# Altium schematic sheet SIWA1-0.SchDoc
size 431 x 279 mm; SheetNumber: 1; SheetTotal: 1
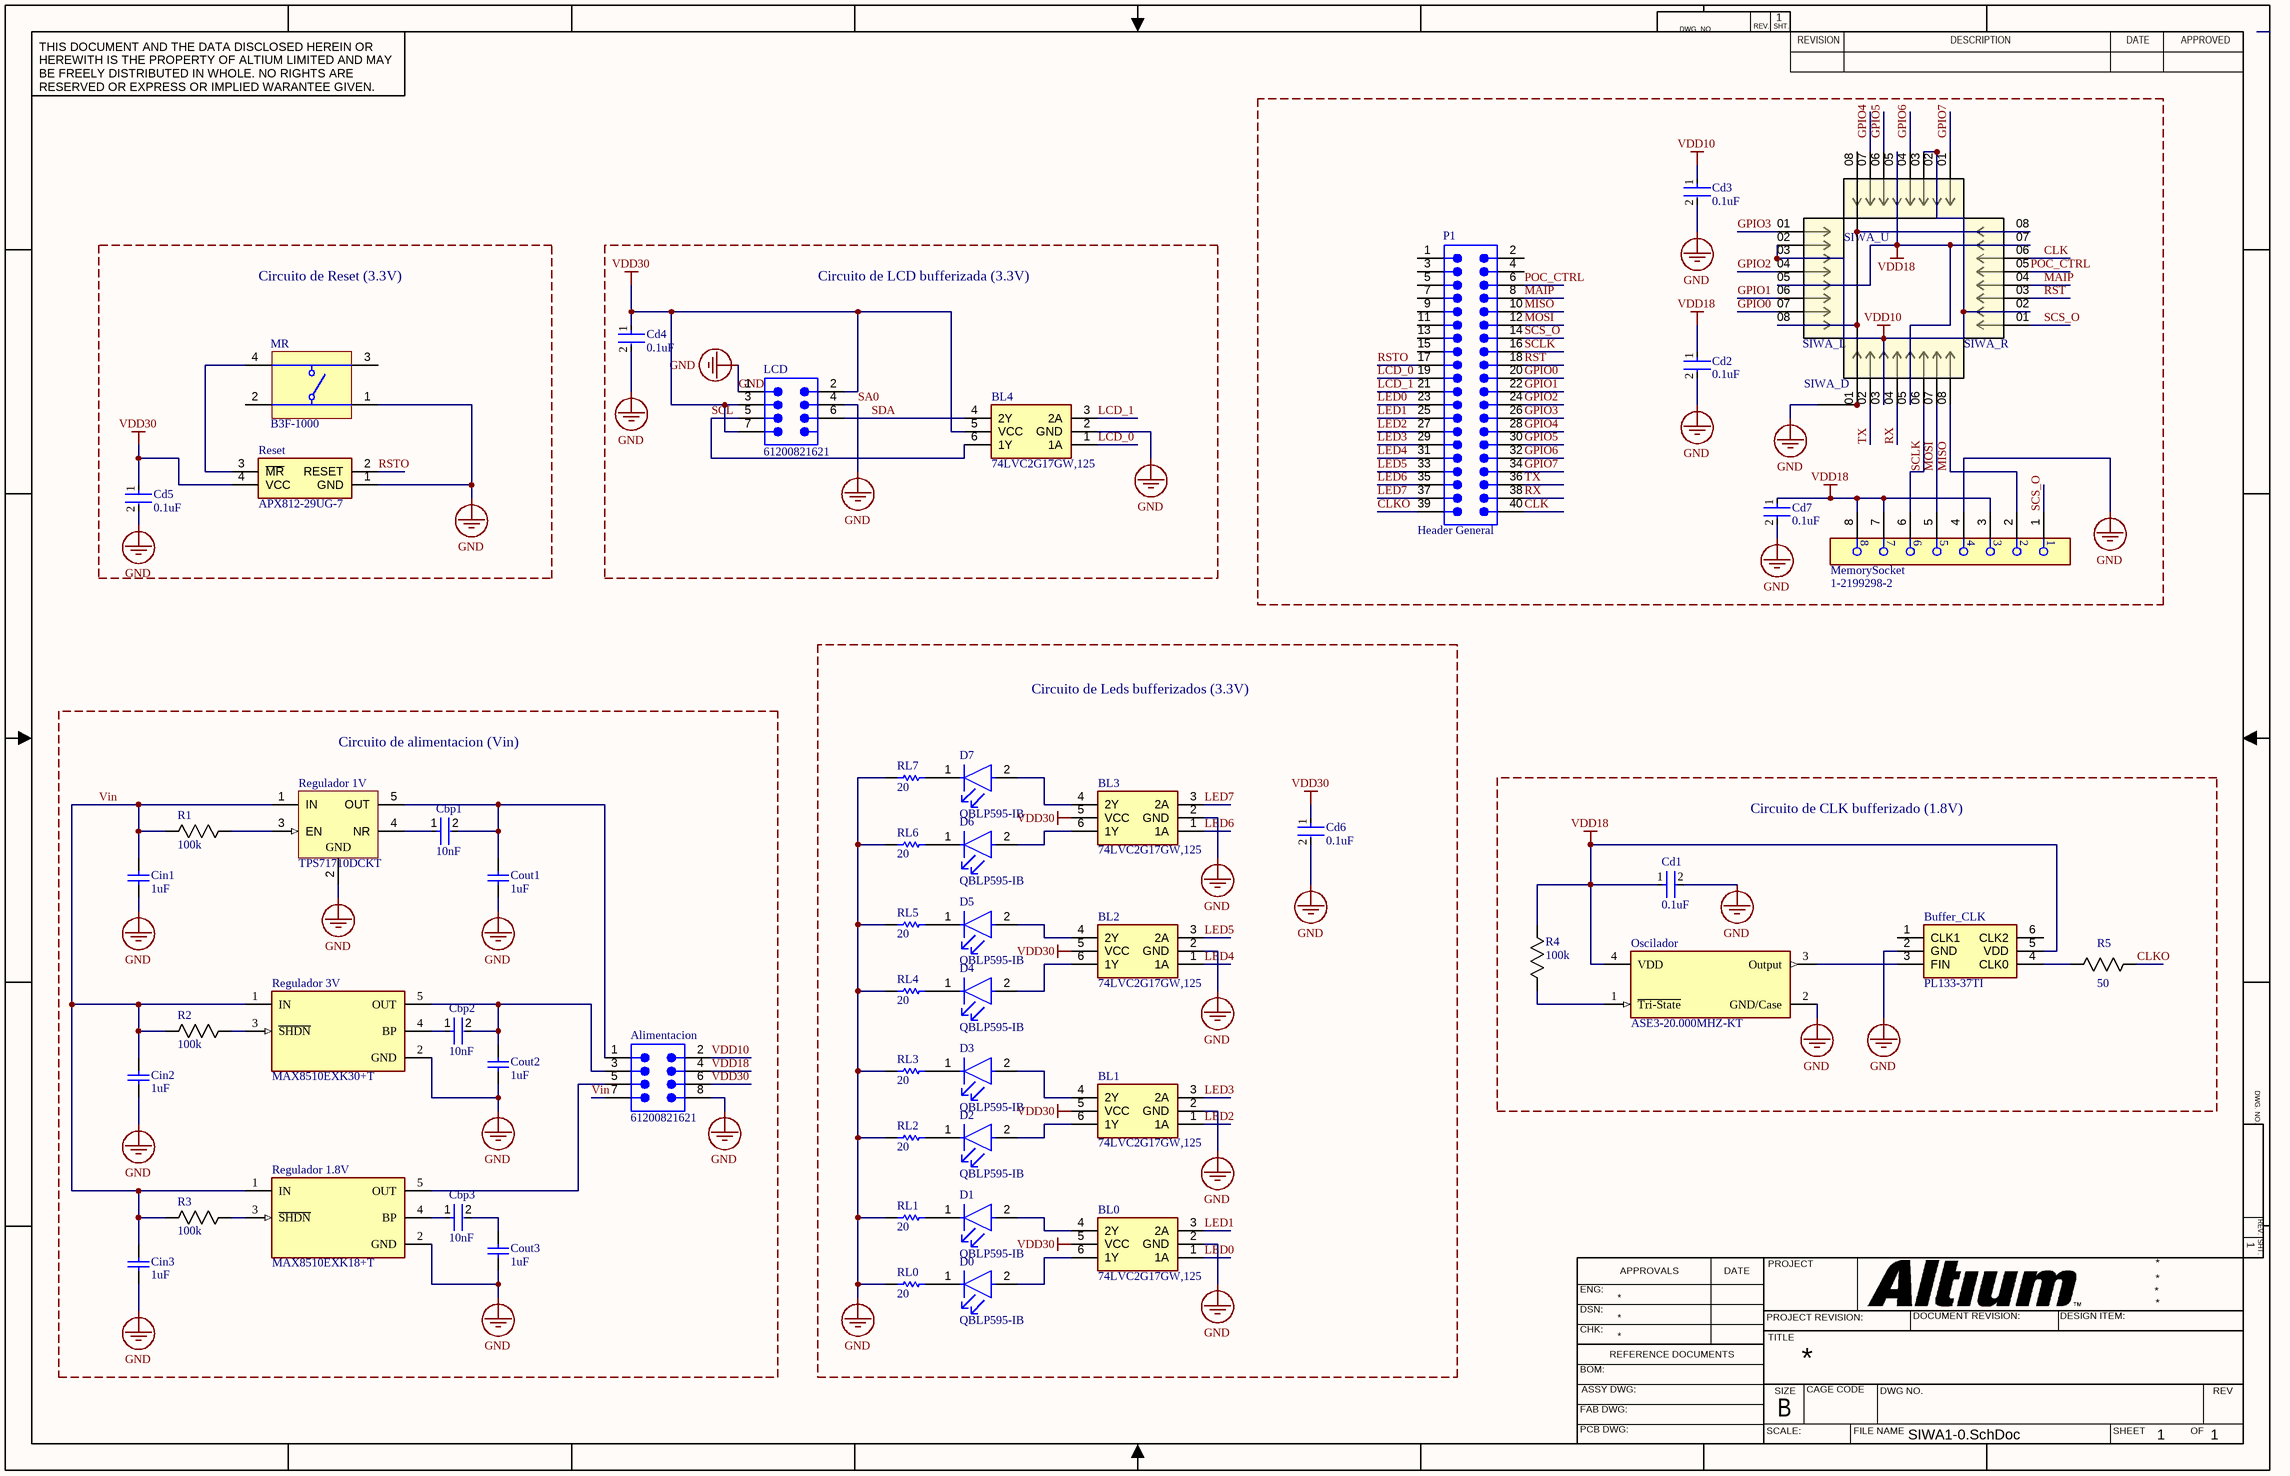
[diagram p0: SIWA1-0.SchDoc]

## Parts
Alimentacion  61200821621  [61200821621]
BL0  74LVC2G17GW,125  [SOT65P210X110-6N]
BL1  74LVC2G17GW,125  [SOT65P210X110-6N]
BL2  74LVC2G17GW,125  [SOT65P210X110-6N]
BL3  74LVC2G17GW,125  [SOT65P210X110-6N]
BL4  74LVC2G17GW,125  [SOT65P210X110-6N]
Buffer_CLK  PL133-37TI  [SOT95P280X145-6N]
Cbp1  10nF  [FP-CGA3E-0_3-0_1-IPC_B]
Cbp2  10nF  [FP-CGA3E-0_3-0_1-IPC_B]
Cbp3  10nF  [FP-CGA3E-0_3-0_1-IPC_B]
Cd1  0.1uF  [FP-0603-L_1_6_0_15-W_0_81-MFG]
Cd2  0.1uF  [FP-0603-L_1_6_0_15-W_0_81-MFG]
Cd3  0.1uF  [FP-0603-L_1_6_0_15-W_0_81-MFG]
Cd4  0.1uF  [FP-0603-L_1_6_0_15-W_0_81-MFG]
Cd5  0.1uF  [FP-0603-L_1_6_0_15-W_0_81-MFG]
Cd6  0.1uF  [FP-0603-L_1_6_0_15-W_0_81-MFG]
Cd7  0.1uF  [FP-0603-L_1_6_0_15-W_0_81-MFG]
Cin1  1uF  [CAPC1609X100X15LL20]
Cin2  1uF  [CAPC1609X100X15LL20]
Cin3  1uF  [CAPC1609X100X15LL20]
Cout1  1uF  [CAPC1609X100X15LL20]
Cout2  1uF  [CAPC1609X100X15LL20]
Cout3  1uF  [CAPC1609X100X15LL20]
D0  QBLP595-IB  [FP-QBLP595-IB-MFG]
D1  QBLP595-IB  [FP-QBLP595-IB-MFG]
D2  QBLP595-IB  [FP-QBLP595-IB-MFG]
D3  QBLP595-IB  [FP-QBLP595-IB-MFG]
D4  QBLP595-IB  [FP-QBLP595-IB-MFG]
D5  QBLP595-IB  [FP-QBLP595-IB-MFG]
D6  QBLP595-IB  [FP-QBLP595-IB-MFG]
D7  QBLP595-IB  [FP-QBLP595-IB-MFG]
LCD  61200821621  [61200821621]
MemorySocket  1-2199298-2  [FP-1-2199298-2-MFG]
MR  B3F-1000  [OMRON-B3F-1000-4_V]
Oscilador  ASE3-20.000MHZ-KT  [FP-ASE3-MFG]
P1  Header General  [61204021621]
R1  100k  [RES_PEP0805-N_VIS]
R2  100k  [RES_PEP0805-N_VIS]
R3  100k  [RES_PEP0805-N_VIS]
R4  100k  [RES_PEP0805-N_VIS]
R5  50  [RES_PEP0805-N_VIS]
Regulador_1.8V  MAX8510EXK18+T  [FP-X5-1-MFG]
Regulador_1V  TPS71710DCKT  [DCK0005A_M]
Regulador_3V  MAX8510EXK30+T  [FP-X5-1-MFG]
Reset  APX812-29UG-7  [APX81229UG7]
RL0  20  [RESC1608X55X30LL15T15]
RL1  20  [RESC1608X55X30LL15T15]
RL2  20  [RESC1608X55X30LL15T15]
RL3  20  [RESC1608X55X30LL15T15]
RL4  20  [RESC1608X55X30LL15T15]
RL5  20  [RESC1608X55X30LL15T15]
RL6  20  [RESC1608X55X30LL15T15]
RL7  20  [RESC1608X55X30LL15T15]
SIWA_D  PPTC081LFBN-RC  [SAMTEC_TS-108-X-A-1]  (value not drawn)
SIWA_L  PPTC081LFBN-RC  [SAMTEC_TS-108-X-A-1]  (value not drawn)
SIWA_R  PPTC081LFBN-RC  [SAMTEC_TS-108-X-A-1]  (value not drawn)
SIWA_U  PPTC081LFBN-RC  [SAMTEC_TS-108-X-A-1]  (value not drawn)

## Blocks framed on the sheet
Circuito de Reset (3.3V): Cd5 MR Reset
Circuito de LCD bufferizada (3.3V): BL4 Cd4 LCD
Circuito de Leds bufferizados (3.3V): BL0-BL3 Cd6 D0-D7 RL0-RL7
Circuito de alimentacion (Vin): Alimentacion Cbp1-Cbp3 Cin1-Cin3 Cout1-Cout3 R1-R3 Regulador_1.8V Regulador_1V Regulador_3V
Circuito de CLK bufferizado (1.8V): Buffer_CLK Cd1 Oscilador R4 R5

## Nets
GND: Alimentacion.8 BL0.2(GND) BL1.2(GND) BL2.2(GND) BL3.2(GND) BL4.2(GND) Buffer_CLK.2(GND) Cd1.2 Cd2.2 Cd3.2 Cd4.2 Cd5.2 Cd6.2 Cd7.2 Cin1.1 Cin2.1 Cin3.1 Cout1.1 Cout2.1 Cout3.1 LCD.1 LCD.4 MemorySocket.4 MR.1 Oscilador.2(GND/Case) Regulador_1.8V.2(GND) Regulador_1V.2(GND) Regulador_3V.2(GND) Reset.1(GND) RL0.1 RL1.1 RL2.1 RL3.1 RL4.1 RL5.1 RL6.1 RL7.1 SIWA_D.01 SIWA_L.08 SIWA_R.08 SIWA_U.08  [also labelled SA0]
VDD10: Alimentacion.2 Cd3.1 SIWA_D.03 SIWA_L.02 SIWA_L.03 SIWA_R.02 SIWA_U.02 SIWA_U.03
VDD18: Alimentacion.4 Buffer_CLK.5(VDD) Cd1.1 Cd2.1 Cd7.1 MemorySocket.3 MemorySocket.7 MemorySocket.8 Oscilador.4(VDD) R4.2 SIWA_D.05 SIWA_L.05 SIWA_R.07 SIWA_U.05
VDD30: Alimentacion.6 BL0.5(VCC) BL1.5(VCC) BL2.5(VCC) BL3.5(VCC) BL4.5(VCC) Cd4.1 Cd5.1 Cd6.1 LCD.2 LCD.3 LCD.7 Reset.4(VCC)
CLK: P1.40 SIWA_R.06
CLKO: P1.39 R5.1
GPIO0: P1.20 SIWA_L.07
GPIO1: P1.22 SIWA_L.06
GPIO2: P1.24 SIWA_L.04
GPIO3: P1.26 SIWA_L.01
GPIO4: P1.28 SIWA_U.07
GPIO5: P1.30 SIWA_U.06
GPIO6: P1.32 SIWA_U.04
GPIO7: P1.34 SIWA_U.01
LCD_0: BL4.1(1A) P1.19
LCD_1: BL4.3(2A) P1.21
LED0: BL0.1(1A) P1.23
LED1: BL0.3(2A) P1.25
LED2: BL1.1(1A) P1.27
LED3: BL1.3(2A) P1.29
LED4: BL2.1(1A) P1.31
LED5: BL2.3(2A) P1.33
LED6: BL3.1(1A) P1.35
LED7: BL3.3(2A) P1.37
MAIP: P1.8 SIWA_R.04
MISO: MemorySocket.2 P1.10 SIWA_D.08
MOSI: MemorySocket.5 P1.12 SIWA_D.07
POC_CTRL: P1.6 SIWA_R.05
RST: P1.18 SIWA_R.03
RSTO: P1.17 Reset.2(RESET)
RX: P1.38 SIWA_D.04
SCL: BL4.6(1Y) LCD.5
SCLK: MemorySocket.6 P1.16 SIWA_D.06
SCS_O: MemorySocket.1 P1.14 SIWA_R.01
SDA: BL4.4(2Y) LCD.6
TX: P1.36 SIWA_D.02
Vin: Alimentacion.7 Cin1.2 Cin2.2 Cin3.2 R1.1 R2.1 R3.1 Regulador_1.8V.1(IN) Regulador_1V.1(IN) Regulador_3V.1(IN)
NetAlimentacion_1: Alimentacion.1 Cbp1.2 Cout1.2 Regulador_1V.5(OUT)
NetAlimentacion_3: Alimentacion.3 Cbp2.2 Cout2.2 Regulador_3V.5(OUT)
NetAlimentacion_5: Alimentacion.5 Regulador_1.8V.5(OUT)
NetBL0_4: BL0.4(2Y) D1.2(A)
NetBL0_6: BL0.6(1Y) D0.2(A)
NetBL1_4: BL1.4(2Y) D3.2(A)
NetBL1_6: BL1.6(1Y) D2.2(A)
NetBL2_4: BL2.4(2Y) D5.2(A)
NetBL2_6: BL2.6(1Y) D4.2(A)
NetBL3_4: BL3.4(2Y) D7.2(A)
NetBL3_6: BL3.6(1Y) D6.2(A)
NetBuffer_CLK_3: Buffer_CLK.3(FIN) Oscilador.3(Output)
NetBuffer_CLK_4: Buffer_CLK.4(CLK0) R5.2
NetCbp1_1: Cbp1.1 Regulador_1V.4(NR)
NetCbp2_1: Cbp2.1 Regulador_3V.4(BP)
NetCbp3_1: Cbp3.1 Regulador_1.8V.4(BP)
NetCbp3_2: Cbp3.2 Cout3.2
NetD0_1: D0.1(C) RL0.2
NetD1_1: D1.1(C) RL1.2
NetD2_1: D2.1(C) RL2.2
NetD3_1: D3.1(C) RL3.2
NetD4_1: D4.1(C) RL4.2
NetD5_1: D5.1(C) RL5.2
NetD6_1: D6.1(C) RL6.2
NetD7_1: D7.1(C) RL7.2
NetMR_4: MR.4 Reset.3(~{MR})
NetOscilador_1: Oscilador.1(~{Tri-State}) R4.1
NetR1_2: R1.2 Regulador_1V.3(EN)
NetR2_2: R2.2 Regulador_3V.3(~{SHDN})
NetR3_2: R3.2 Regulador_1.8V.3(~{SHDN})

Not connected (* = marked no-connect by the designer): Buffer_CLK 1(CLK1) 6(CLK2); LCD 8; MR 2 3; P1 1 2 3 4 5 7 9 11 13 15

## Notes on the sheet
- DWG. NO.
- REV.
- SHT.
- THIS DOCUMENT AND THE DATA DISCLOSED HEREIN OR HEREWITH IS THE PROPERTY OF ALTIUM LIMITED AND MAY BE FREELY DISTRIBUTED IN WHOLE. NO RIGHTS ARE RESERVED OR EXPRESS OR IMPLIED WARANTEE GIVEN.
- REVISION
- DESCRIPTION
- DATE
- APPROVED
- ENG:
- APPROVALS
- PROJECT
- DSN:
- CHK:
- REFERENCE DOCUMENTS
- PROJECT REVISION:
- TITLE
- DOCUMENT REVISION:
- DESIGN ITEM:
- BOM:
- FAB DWG:
- PCB DWG:
- ASSY DWG:
- SCALE:
- SIZE
- B
- CAGE CODE
- FILE NAME
- DWG NO.
- SHEET
- OF
- REV

## Library data of the parts
Alimentacion LCD = CMP-1502-00006-2: NexarPartId: 32855460; Gender: Male; Row Spacing: 2.54mm; Connector Type: Male Pin; Insulation Resistance: 1GΩ; Contact Resistance: 20mΩ; Number of Positions: 8; Current Rating: 3A; Operating Supply Voltage: 250V; Orientation: Vertical; Lead Pitch: 2.54mm; Length: 17.82mm; Max Operating Temperature: 105°C; Mount: Through Hole; Color: Black; Insulation Material: PBT; RoHS: Compliant; Contact Material: Copper; Number of Contacts: 8; Pitch: 2.54mm; Contact Plating: Gold; Min Operating Temperature: -40°C; Number of Pins: 8; Termination: Solder; REACH SVHC: Unknown; Number of Rows: 2
BL0-BL4 = 74LVC2G17GW,125: Integrated Circuit; Manufacturer_Name: Nexperia; Datasheet Link: https://assets.nexperia.com/documents/data-sheet/74LVC2G17.pdf; Height: 1.1mm; Manufacturer_Part_Number: 74LVC2G17GW,125; Mouser Part Number: 771-LVC2G17GW125; Mouser Price/Stock: https://www.mouser.co.uk/ProductDetail/Nexperia/74LVC2G17GW125?qs=me8TqzrmIYUC6E0%2FnH98oA%3D%3D; Arrow Part Number: 74LVC2G17GW,125; Arrow Price/Stock: https://www.arrow.com/en/products/74lvc2g17gw125/nexperia?utm_currency=USD&region=nac
Buffer_CLK = PL133-37TI: Integrated Circuit; Manufacturer_Name: Microchip; Datasheet Link: http://www.microchip.com/mymicrochip/filehandler.aspx?ddocname=en580976; Height: 1.45mm; Manufacturer_Part_Number: PL133-37TI; Mouser Part Number: 998-PL133-37TI; Mouser Price/Stock: https://www.mouser.co.uk/ProductDetail/Microchip-Technology/PL133-37TI?qs=kh6iOki%2FeLE%2FQlQVb6vWpw%3D%3D; Arrow Part Number: PL133-37TI; Arrow Price/Stock: https://www.arrow.com/en/products/pl133-37ti/microchip-technology?utm_currency=USD&region=nac
Cbp1-Cbp3 = CMP-08246-000560-1: Cap Ceramic 10nF 100V C0G 5% Pad SMD 0603 +125°C Automotive T/R; Mount: Surface Mount; Packaging: Tape and Reel; Min Operating Temperature: -55°C; Termination: SMD/SMT; Case Code (Metric): 1608; Voltage Rating (DC): 100V; Package Quantity: 4000; Max Operating Temperature: 125°C; Composition: Ceramic; Dielectric: C0G; Tolerance: 5%; Length: 0.063inch; Height: 0.8mm; Lead Free: Lead Free; Voltage Rating: 100V; Width: 0.031inch; Capacitance: 10nF; Case/Package: 0603; Thickness: 0.035inch; Case Code (Imperial): 0603; Ratings: AEC-Q200; Weight: 7.1E-05oz
Cd1-Cd7 = CMP-07738-136560482-1: KGM15BR71H104JT Cap Cer 0.1UF 50V X7R 0603; Capacitance: 100nF; Tolerance: 5%; Material: Ceramic; NexarPartId: 136560482; Height: 940µm; Voltage Rating: 50V; Case/Package: 0603; Max Operating Temperature: 125°C; Min Operating Temperature: -55°C
Cin1-Cin3 Cout1-Cout3 = CMP-2006-00183-1: Manufacturer: AVX Interconnect / Elco; Part Number: TACL105K006XTA
D0-D7 = CMP-113271-000002-1: LED BLUE CLEAR 0402 SMD; Lens Size: 0.5mm; Dominant Wavelength: 465nm; Forward Voltage: 3.1V; Lens Color: Colorless; Luminous Intensity: 85mcd; Test Current: 20mA; Viewing Angle: 140°; Lens Style: Flat; Width: 0.5mm; Case Code (Metric): 1005; Lens Transparency: Clear; Color: Blue; Packaging: Tape and Reel; Case Code (Imperial): 0402; Mount: Surface Mount; Length: 1mm; Case/Package: 0402; Height: 0.6mm
MemorySocket = CMP-03370-000009-1: CONN IC DIP SOCKET 8POS TIN; Contact Post Length: 3inch; Number of Contacts: 8; Contact Current Rating: 1A; Contact Resistance: 20mR; Insulation Resistance: 1GR; Connector Type: Pin; Row Spacing: 0.3inch; Pitch: 2.54mm; Mating Alignment: Yes (With); RoHS Compliant: Yes; Packaging: Rail/Tube; Contact Material: Bronze; Lead Pitch: 2.54mm; Mount: Through Hole; Termination: Through Hole; Max Operating Temperature: 105°C; Flammability Rating: UL94 V-0; Package Quantity: 60; Contact Finish - Mating: TIN; ELV: Compliant; Radiation Hardening: No; Number of Rows: 2; Series: Diplomate DL; Color: Black; Number of Positions: 8; Contact Plating: Tin; Min Operating Temperature: -40°C; Lead Free: Lead Free; Length: 0.4inch; Orientation: Straight; Housing Material: PBT
MR = CMP-1677-00002-1: Tactile Switch, SPST-NO, 0.05 A, 5 to 24 V, -25 to 70 degC, 4-Pin THD, RoHS, Bulk; Shielding: Shielded; Gender: Female; Capacitance: -45 f; Voltage Rating: 150 V; Current Rating: 1.5 A; Radiation Hardening: No; Contact Plating: Gold; Height: 14.99 mm; Min Operating Temperature: -40 degC; Packaging: Tray; ComponentLink2Description: Datasheet; ComponentLink1URL: http://www.omron.com/; Lead Pitch: 1.27 mm; RoHSCompliant: true; Pins: 8; PackageReference: B3F-1000; Width: 25.4 mm; Contact Material: Brass; ComponentLink2URL: http://www.omron.com/ecb/products/pdf/en-b3f.pdf; PackageDescription: 4-Pin Through Hole Device, Body 6 x 6 mm; DatasheetVersion: Jan-15; ComponentLink1Description: Manufacturer URL; Package Quantity: 1080; Mount: Through Hole; Length: 18.34 mm; Max Operating Temperature: 70 degC
Oscilador = CMP-27762-010045-1: XTAL OSC XO 20.0000MHZ CMOS SMD; Min Supply Voltage: 1.71V; Max Supply Current: 4mA; Operating Supply Voltage: 1.8V; Max Supply Voltage: 1.89V; Frequency: 20MHz; Frequency Stability: 30ppm; Load Capacitance: 15pF; Length: 3.2mm; Mount: Surface Mount; Min Operating Temperature: -10°C; Max Operating Temperature: 70°C; Series: ASE3; Height: 0.049inch; Package Quantity: 1000; Depth: 2.5mm; Case/Package: SMD/SMT; Number of Pins: 4; Lead Free: Lead Free; Width: 0.098inch; Termination: SMD/SMT; Packaging: Tape and Reel; Radiation Hardening: No
P1 = CMP-1502-00015-3: NexarPartId: 25903616; Gender: Male; Row Spacing: 2.54mm; Connector Type: Male Pin; Current Rating: 3A; Number of Positions: 40; Voltage Rating: 250V; Insulation Resistance: 1GΩ; Contact Resistance: 20mΩ; RoHS: Compliant; Color: Black; Pitch: 2.54mm; Orientation: Vertical; Contact Plating: Gold; Lead Pitch: 2.54mm; REACH SVHC: Unknown; Termination: Solder; Max Operating Temperature: 105°C; Insulation Material: PBT; Number of Rows: 2; Min Operating Temperature: -40°C; Number of Pins: 40; Mount: Through Hole; Contact Material: Copper; Number of Contacts: 40; Height: 9.25mm; Length: 58.46mm; Operating Supply Voltage: 250V
R1-R4 = CMP-00030-123138495-1: PEP0805Y1003BNTA Resistor High Precision Thin Film 0805 100k Ohm 0.1% 1/2W ±10ppm/°C Molded T/R; NexarPartId: 123138495
R5 = CMP-00030-123138495-1: PEP0805Y1003BNTA Resistor High Precision Thin Film 0805 50 Ohm 0.1% 1/2W ±10ppm/°C Molded T/R; NexarPartId: 123138495
Regulador_1.8V = CMP-0246-00401-2: IC REG LINEAR 1.8V 120MA SC70-5; Accuracy: 2%; Number of Outputs: 1; Min Current Limit: 130mA; Max Input Voltage: 6V; Max Power Dissipation: 247mW; Output Configuration: Positive; Output Type: Fixed; Quiescent Current: 90uA; Reference Voltage: 1.225V; Min Input Voltage: 2V; Power Supply Rejection Ratio (PSRR): 54dB; Input Bias Current: 40uA; Output Current: 120mA; Nominal Output Voltage: 1.8V; Output Voltage: 1.8V; Series: -; Number of Regulators: 1; Packaging: Tape and Reel; Mount: Surface Mount; Case/Package: SC; Lead Free: Lead Free; RoHS Compliant: Yes; Number of Pins: 5; Package Quantity: 2500; Max Output Current: 120mA; Polarity: Positive; Min Operating Temperature: -40°C; Max Operating Temperature: 85°C
Regulador_1V = CMP-0394-00843-2: Single Output High PSRR LDO, 150 mA, Fixed 1 V Output, 2.5 to 6.5 V Input, with Low IQ, 5-pin SC70 (DCK), -40 to 85 degC, Green (RoHS & no Sb/Br); Manufacturer: Texas Instruments; Fixed Output Options(V): 1; Iq(Typ)(mA): 0.05; Vdo(Typ)(mV): 170; Vin(Min)(V): 2.5; Vin(Max)(V): 6.5; Iout(Max)(A): 0.15; Accuracy(%): 3; SubFamily: Single Channel LDO; PackageReference: DCK0005A; Mounting Technology: Surface Mount; Vout Adj(Max)(V): 1; Eco-Plan: Green (RoHS & no Sb/Br); Vout Adj(Min)(V): 1; ComponentLink1URL: http://www.ti.com/; ComponentLink1Description: Manufacturer URL; ComponentLink2URL: http://www.ti.com/general/docs/lit/getliterature.tsp?genericPartNumber=TPS71710&fileType=pdf; ComponentLink3Description: Package Specification; ComponentLink3URL: http://www.ti.com/litv/pdf/mpds025f; Code_JEDEC: MO-203; DatasheetVersion: SBVS068G; ComponentLink2Description: Datasheet; PackageVersion: 4093553-3/G; PackageDescription: 5-Pin Plastic Small-Outline, Body 2 x 1.25 mm, Pitch 0.65 mm; PartNumber: TPS71710DCKT
Regulador_3V = CMP-0246-00520-2: IC REG LINEAR 3V 120MA SC70-5; Output Configuration: Positive; Dropout Voltage: 120mV; Min Current Limit: 130mA; Number of Outputs: 1; Max Input Voltage: 6V; Power Supply Rejection Ratio (PSRR): 54dB; Reference Voltage: 1.225V; Min Input Voltage: 2V; Max Power Dissipation: 247mW; Accuracy: 2%; Input Bias Current: 40uA; Output Type: Fixed; Quiescent Current: 90uA; Output Current: 120mA; Nominal Output Voltage: 3V; Max Output Current: 120mA; Package Quantity: 2500; Polarity: Positive; Number of Pins: 5; RoHS Compliant: Yes; Output Voltage: 3V; Mount: Surface Mount; Lead Free: Lead Free; Case/Package: SC; Number of Regulators: 1; Packaging: Tape and Reel; Series: -; Min Operating Temperature: -40°C; Radiation Hardening: No; Max Operating Temperature: 85°C
Reset = APX812-29UG-7: I_O=20mA; Manufacturer_Name: Diodes Incorporated; Datasheet Link: https://www.diodes.com//assets/Datasheets/APX811_812.pdf; Height: 1.1mm; Manufacturer_Part_Number: APX812-29UG-7; Mouser Part Number: 621-APX812-29UG-7; Mouser Price/Stock: https://www.mouser.co.uk/ProductDetail/Diodes-Incorporated/APX812-29UG-7?qs=uwE%252BXfKqZqTVBV%252BbZr8J2A%3D%3D; Arrow Part Number: APX812-29UG-7; Arrow Price/Stock: https://www.arrow.com/en/products/apx812-29ug-7/diodes-incorporated
RL0-RL7 = CMP-2000-00325-1: Part Number: ERJ-3EKF20R0V; Manufacturer: Panasonic
SIWA_D SIWA_L SIWA_R SIWA_U = PPTC081LFBN-RC: Description; Manufacturer_Name: Sullins; Copyright: Copyright (C) 2025 Ultra Librarian. All rights reserved.; Manufacturer_Part_Number: PPTC081LFBN-RC; RefDes: RefDes; Type: Type